# Altium schematic sheet Switch and Encoder.SchDoc
size Letter
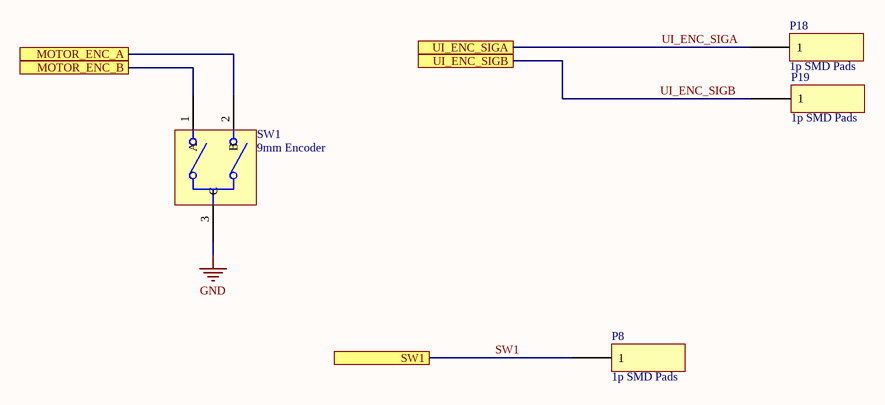
[diagram p0: Switch and Encoder.SchDoc]

## Parts
P8  1p SMD Pads  [1p SMD pad]
P18  1p SMD Pads  [1p SMD pad]
P19  1p SMD Pads  [1p SMD pad]
SW1  9mm Encoder  [9mm encoder]

## Ports
MOTOR_ENC_A, MOTOR_ENC_B, SW1, UI_ENC_SIGA, UI_ENC_SIGB

## Nets
GND: SW1.3(C)
MOTOR_ENC_A: SW1.2(B) ; port MOTOR_ENC_A
MOTOR_ENC_B: SW1.1(A) ; port MOTOR_ENC_B
SW1: P8.1 ; port SW1
UI_ENC_SIGA: P18.1 ; port UI_ENC_SIGA
UI_ENC_SIGB: P19.1 ; port UI_ENC_SIGB

## Notes on the sheet
- Title
- Size:
- Date:
- Letter
- Number:
- Time:
- Revision:
- Sheet
- of
- Copyright 2019
- Specialized Solutions LLC
- 206 W Lincoln Hwy STE B
- New Haven, IN 46774
- www.specsolns.com <http://www.specsolns.com>
- File:

## Library data of the parts
P8 P18 P19 = 1p SMD